# EAGLE design BusPirate-ultra-proto-adj_vreg.v.0 (EAGLE 9.1.3)
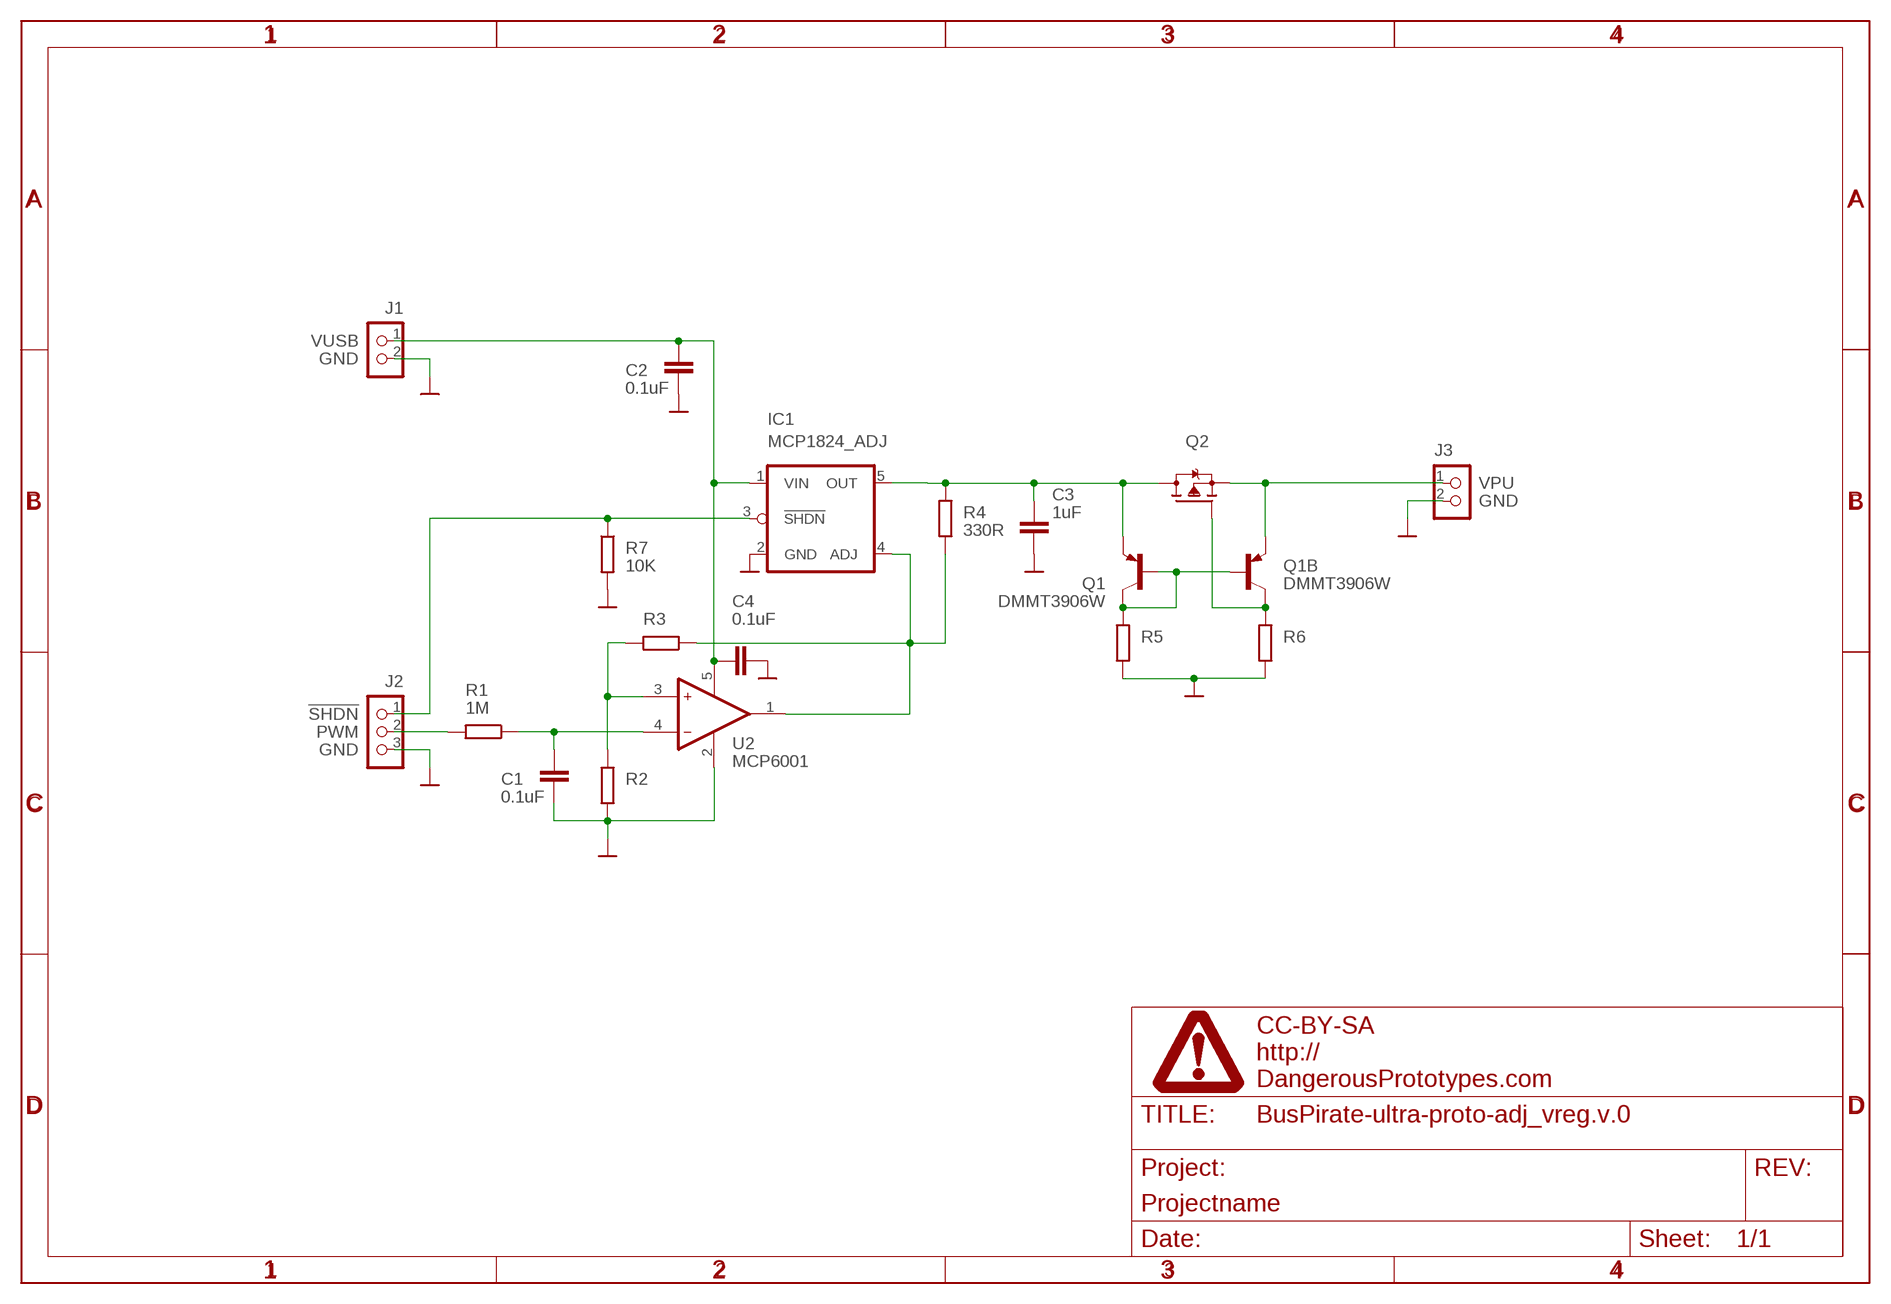
[diagram p0: schematic, sheet 1]

## Parts
C1  0.1uF  CAPACITOR_NPOL-0603  [C603]
C2  0.1uF  CAPACITOR_NPOL-0603  [C603]
C3  1uF  CAPACITOR_NPOL-0603  [C603]
C4  0.1uF  CAPACITOR_NPOL-0603  [C603]
IC1  MCP1824_ADJ  IC_MCP1824_ADJ  [SOT-23-5]
J1  CON_HEADER_1X02-PTH  [M1X2]
J2  CON_HEADER_1X03-PTH  [M1X3]
J3  CON_HEADER_1X02-PTH  [M1X2]
PAGE1  FRAME_DINA4_L  [DP_LOGO]
Q1  DMMT3906W  TRANSISTOR-BJT_DMMT3906W  [SOT-363]
Q2  TRANSISTOR_FET_TSM2301CX  [SOT-23]
R1  1M  RESISTOR-0603  [R603]
R2  RESISTOR-0603  [R603]
R3  RESISTOR-0603  [R603]
R4  330R  RESISTOR-0603  [R603]
R5  RESISTOR-0603  [R603]
R6  RESISTOR-0603  [R603]
R7  10K  RESISTOR-0603  [R603]
U2  MCP6001  IC_OP-AMP_MCP6001  [SOT-23-5]

## Nets
!SHDN: IC1.3(!SHDN) J2.1 R7.1
GND: C1.2 C2.2 C3.2 C4.2 IC1.2(GND) J1.2 J2.3 J3.2 R2.2 R5.1 R6.1 R7.2 U2.2(V-) ; supply symbol labelled SUPPLY_GND
N$1: C3.1 IC1.5(OUT) Q1.4(E) Q2.3(D) R4.2
N$2: Q1.1(B) Q1.2(B) Q1.3(C) R5.2
N$4: Q1.6(C) Q2.1(G) R6.2
N$8: IC1.4(ADJ) R3.1 R4.1 U2.1(OUT)
N$9: R2.1 R3.2 U2.3(+)
N$10: C1.1 R1.1 U2.4(-)
PWM: J2.2 R1.2
VPU: J3.1 Q1.5(E) Q2.2(S)
VUSB: C2.1 C4.1 IC1.1(VIN) J1.1 U2.5(V+)

## Library data of the parts
C1-C4 = dp_devices.v6:CAPACITOR_NPOL: Non-Polarized capacitor in various packages
IC1 = dp_devices.v6:IC_MCP1824_ADJ: MCP1824 ADJ 300mA, Low voltage, Low Quiescent current adjustable LDO regulator
J1 J3 = dp_devices.v6:CON_HEADER_1X02
J2 = dp_devices.v6:CON_HEADER_1X03
PAGE1 = dp_devices.v6:FRAME_DINA4_L: A4 DP frame Standard Dangerous Prototypes schematic frame. Automagically adds the DP logo and standard texts to the PCB Use the atrribute in the schematic editor to change the fields.; FF1: fulfillment by; FF2: Seeed Studio; FF3: www.seeedstudio.com; LICENSE: CC-BY-SA; PROJECT: Projectname; URL1: http://; URL2: DangerousPrototypes.com
Q1 = dp_devices.v6:TRANSISTOR-BJT_DMMT3906W: Matched pair PNP small signal transistor -40V -200mA
Q2 = dp_devices.v6:TRANSISTOR_FET_TSM2301CX: 20V P-Channel Enhancement Mode MOSFET
R1-R7 = dp_devices.v6:RESISTOR
U2 = dp_devices.v6:IC_OP-AMP_MCP6001: 1 MHz, Low-Power Op Amp

## Board
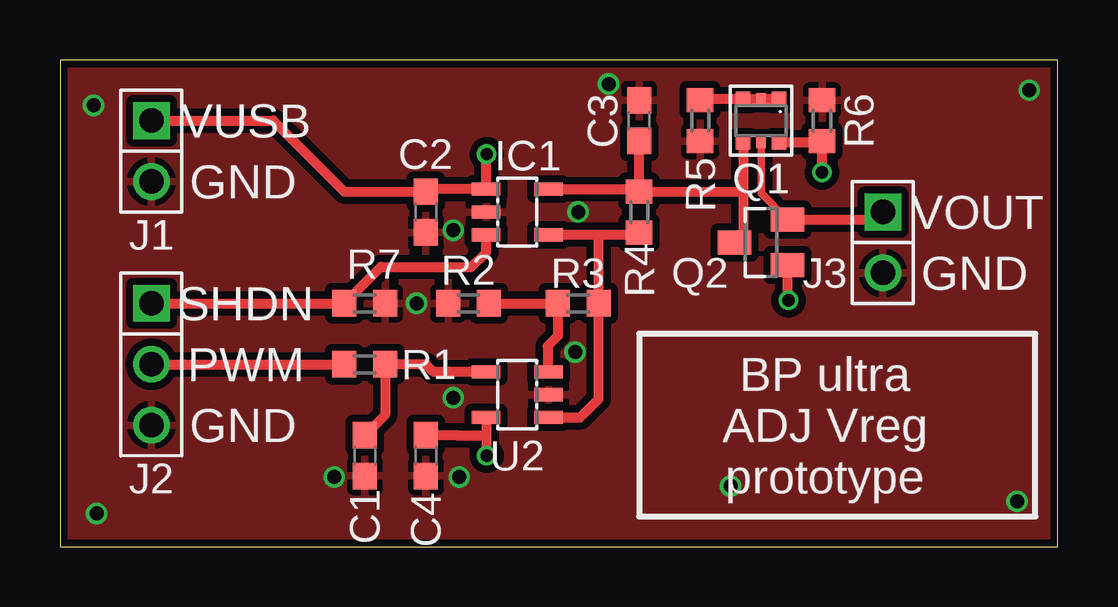
[diagram p1: board, top side]
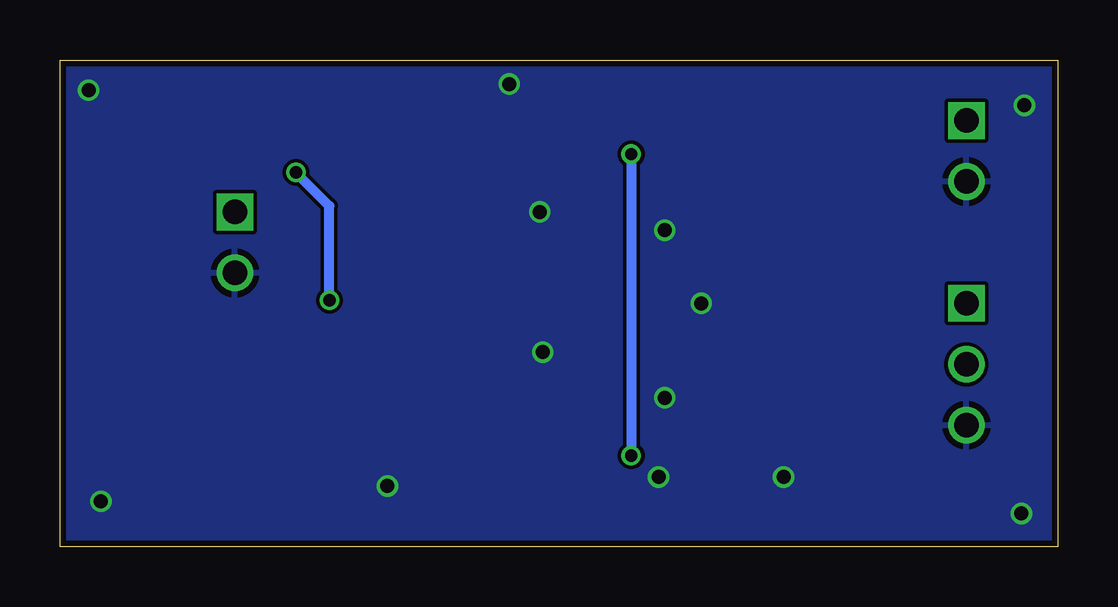
[diagram p2: board, bottom side, seen from below]

Size 41.58 x 20.31 mm. Coordinates in mm from the lower left corner, seen from the top.
Outline: 0,0 41.58,0 41.58,20.31 0,20.31 0,0
Copper layers (1*16): Top 0.035mm / dielectric 1.5mm / Bottom 0.035mm
Design rules "dirt_cheap_dirty_boards.v1.1": minimum track width 6mil, minimum drill 12mil, track to track 6mil, track to pad 6mil, pad to pad 6mil, via to via 6mil, smd to smd 0mil, copper to edge 10mil, drill to drill 10mil, minimum pad ring 10mil, minimum via ring 6mil, stop-mask expansion 2mil, vias tented up to drill 25mil, thermal gap 10mil

### Footprints (pad centres in the part's own frame; a part is rotated, then mirrored left to right if it is on the bottom)
C603 = smd 1.1 x 1: 1 -0.85,0; 2 0.85,0
SOT-23-5 = smd 0.55 x 1.2: 1 -0.95,-1.3; 2 0,-1.3; 3 0.95,-1.3; 4 0.95,1.3; 5 -0.95,1.3
M1X2 = drill 1.02 square: 1 -1.27,0 | drill 1.02: 2 1.27,0
M1X3 = drill 1.02 square: 1 0,0 | drill 1.02: 2 2.54,0; 3 5.08,0
SOT-363 = smd 0.6 x 0.6: 1 -0.75,-0.9; 3 0.75,-0.9; 4 0.75,0.9; 6 -0.75,0.9 | smd 0.4 x 0.5: 2 0,-0.9; 5 0,0.9
SOT-23 = smd 1 x 1.4: 1 -0.95,-1.1; 2 0.95,-1.1; 3 0,1.1
R603 = smd 1 x 1.1: 1 -0.85,0; 2 0.85,0

### Placement (x,y rotation side)
C1  12.7,3.81 270 top
C2  15.24,13.97 270 top
C3  24.13,17.78 90 top
C4  15.24,3.81 270 top
IC1  19.05,13.97 270 top
J1  3.81,16.51 270 top
J2  3.81,10.16 270 top
J3  34.29,12.7 270 top
PAGE1  2.54,-5.08 0 top  (outside the outline)
Q1  29.21,17.78 180 top
Q2  29.21,12.7 90 top
R1  12.7,7.62 180 top
R2  17.02,10.16 180 top
R3  21.59,10.16 180 top
R4  24.13,13.97 90 top
R5  26.67,17.78 90 top
R6  31.75,17.78 270 top
R7  12.7,10.16 0 top
U2  19.05,6.35 90 top

### Tracks (layer width: path | path; a pad name or v marks a point on that pad's centre or on a via)
!SHDN
  Top 0.406: J2.1 R7.1 13.37,11.68 17.14,11.68 17.75,12.29 IC1.3
GND  (via drill 0.58)
  other vias: 16.38,13.21 40.39,19.05 16.64,2.92 1.52,1.4 1.4,18.41 11.43,2.92 39.88,1.91 27.94,2.54 22.86,19.3 14.86,10.16 21.59,13.97 16.38,6.22 21.46,8.13
  pour Top (isolate 0.305, rank 6): 0,20.32 41.91,20.32 41.91,0 0,0
  pour Bottom (rank 6): 0,20.32 41.91,20.32 41.91,0 0,0
N$1
  Top 0.406: IC1.5 24.13,14.92 R4.2 | R4.2 C3.1 | Q1.4 28.46,14.86 | 28.46,14.86 28.46,13.05 Q2.3 | 28.46,14.86 28.42,14.82 R4.2
N$2
  Top 0.406: Q1.1 Q1.2 Q1.3 26.72,18.68 R5.2
N$4  (via drill 0.51)
  Top 0.406: Q1.6 31.7,16.88 R6.2 v31.75,15.62 | Q2.1 30.31,10.33 v30.35,10.29
  Bottom 0.406: v30.35,10.29 30.35,14.22 v31.75,15.62
N$8
  Top 0.406: U2.1 21.67,5.4 22.44,6.17 R3.1 22.44,13.02 22.86,13.02 | IC1.4 22.86,13.02 | 22.86,13.02 24.03,13.02 R4.1
N$9
  Top 0.406: R2.1 R3.2 20.74,8.8 20.32,8.38 20.32,7.33 U2.3
N$10
  Top 0.406: C1.1 13.55,5.51 R1.1 15.24,7.62 15.56,7.3 U2.4
PWM
  Top 0.406: J2.2 R1.2
VPU
  Top 0.305: Q1.5 29.21,14.75 Q2.2
  Top 0.406: Q2.2 33.97,13.65 J3.1
VUSB  (via drill 0.51)
  Top 0.406: J1.1 8.89,17.78 11.85,14.82 C2.1 15.34,14.92 IC1.1 17.75,16.35 v17.78,16.38 | C4.1 16.51,4.66 17.78,4.66 17.78,5.08 | v17.78,3.81 17.78,5.08 | 17.78,5.08 17.78,5.37 U2.5
  Bottom 0.406: v17.78,16.38 v17.78,3.81

### Text on the board
tNames: VUSB | GND | VOUT | GND | SHDN | PWM | GND | BP ultra / ADJ Vreg / prototype